# Altium project STM32MiniSYS.PrjPcb
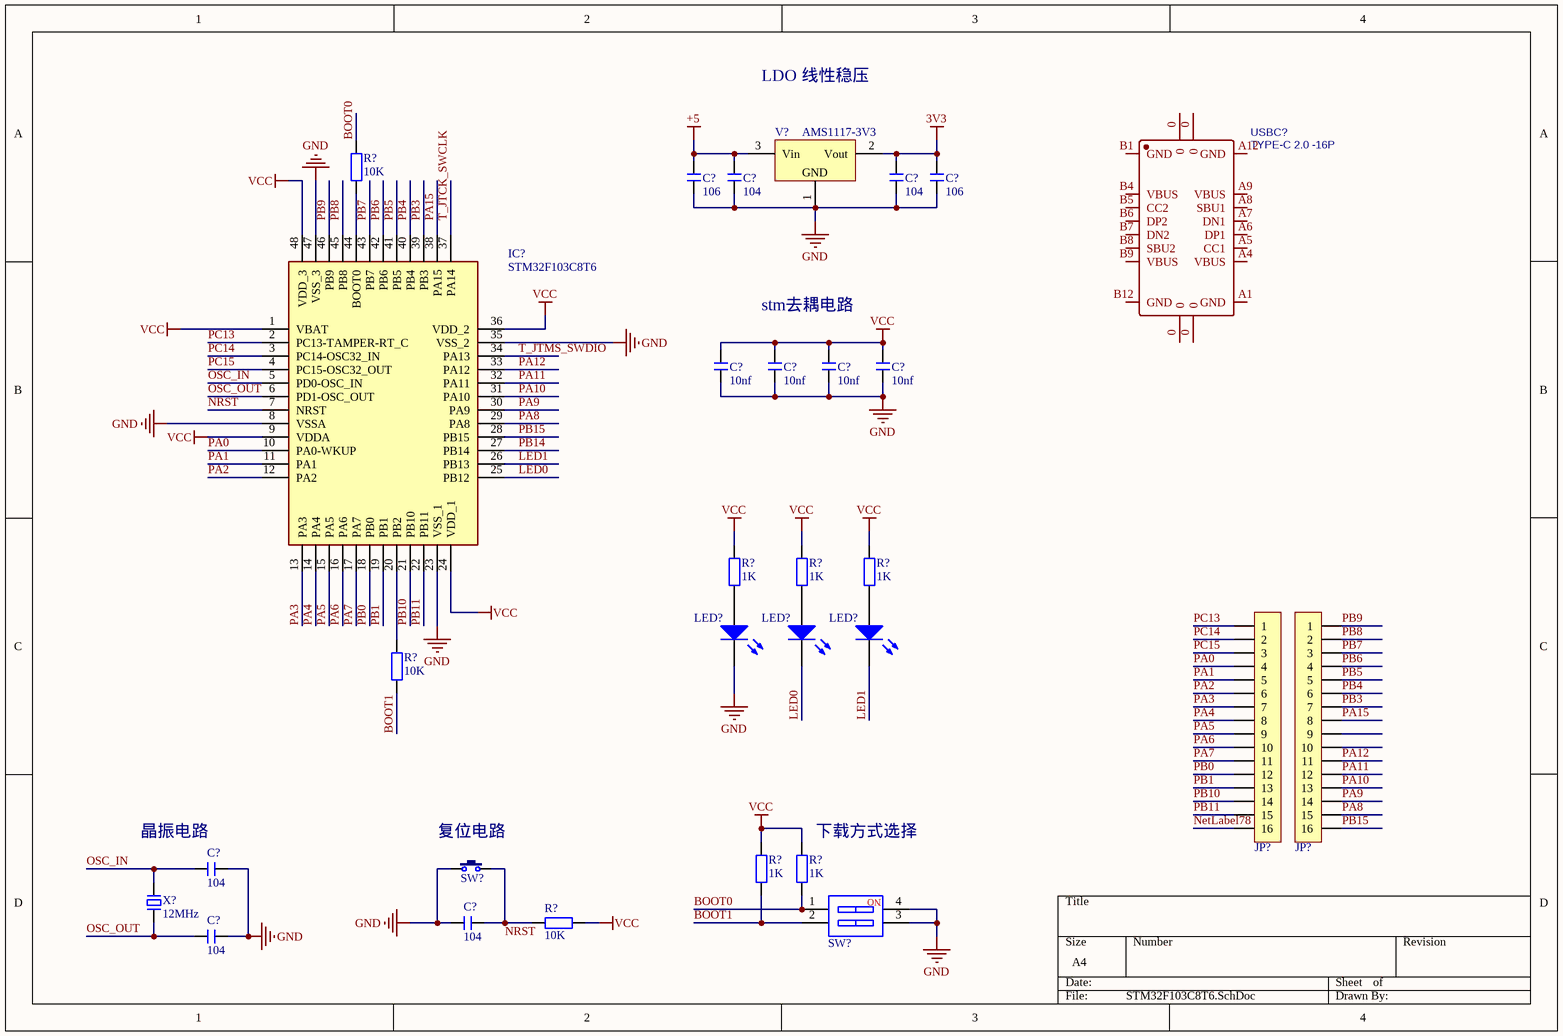
[diagram p0: STM32F103C8T6.SchDoc]
2 sheets, 52 parts. Net scope: global (net labels, ports and power ports of the same name join across sheets).
Board file: PCB.PcbDoc
Sheets:
  STM32F103C8T6.SchDoc
  ST-LINK.SchDoc

## Sheet STM32F103C8T6.SchDoc
size A4; SheetNumber: 1; SheetTotal: 2

### Parts
(Parts that share a designator on the sheet are numbered #1, #2 ... from top to bottom, then left to right.)
C?#1  106  [C0201_L]
C?#2  104  [C0201_L]
C?#3  104  [C0201_L]
C?#4  106  [C0201_L]
C?#5  10nf  [C0201_L]
C?#6  10nf  [C0201_L]
C?#7  10nf  [C0201_L]
C?#8  10nf  [C0201_L]
C?#9  104  [C0201_L]
C?#10  104  [C0201_L]
C?#11  104  [C0201_L]
IC?#1  STM32F103C8T6  [QFP50P900X900X160-48N]
JP?#1  HDR-1X16  [HDR2.54-LI-16P]  (value not drawn)
JP?#2  HDR-1X16  [HDR2.54-LI-16P]  (value not drawn)
LED?#1  (no value)  [LED0603_G]
LED?#2  (no value)  [LED0603_G]
LED?#3  (no value)  [LED0603_G]
R?#1  10K  [R0805_L]
R?#2  1K  [R0805_L]
R?#3  1K  [R0805_L]
R?#4  1K  [R0805_L]
R?#5  10K  [R0805_L]
R?#6  1K  [R0805_L]
R?#7  1K  [R0805_L]
R?#8  10K  [R0805_L]
SW?#1  3x6x5  [SW SMD-3*6*5]  (value not drawn)
SW?#2  SW-2P  [SW DIP-2P]  (value not drawn)
USBC?  TYPE-C 2.0 -16P  [USB-C-SMD_TYPE-C-USB-5]
V?  AMS1117-3V3  [SOT223_L]
X?#1  12MHz  [OSC 5032-2P]

### Nets
3V3: C?#3.2 C?#4.2 V?.2(Vout)
+5: C?#1.2 C?#2.2 V?.3(Vin)
GND: C?#1.1 C?#2.1 C?#3.1 C?#4.1 C?#5.1 C?#6.1 C?#7.1 C?#8.1 C?#9.2 C?#10.1 C?#11.2 IC?#1.8(VSSA) IC?#1.23(VSS_1) IC?#1.35(VSS_2) IC?#1.47(VSS_3) LED?#1.2(K) SW?#1.1 SW?#2.3 SW?#2.4 V?.1(GND)
VCC: C?#5.2 C?#6.2 C?#7.2 C?#8.2 IC?#1.1(VBAT) IC?#1.9(VDDA) IC?#1.24(VDD_1) IC?#1.36(VDD_2) IC?#1.48(VDD_3) R?#2.2 R?#3.2 R?#4.2 R?#6.2 R?#7.2 R?#8.2
BOOT0: R?#1.2 R?#7.1 SW?#2.1
BOOT1: R?#5.1 R?#6.1 SW?#2.2
LED0: IC?#1.25(PB12) LED?#2.2(K)
LED1: IC?#1.26(PB13) LED?#3.2(K)
NetLabel78: JP?#1.16
NRST: C?#10.2 IC?#1.7(NRST) R?#8.1 SW?#1.2
OSC_IN: C?#9.1 IC?#1.5(PD0-OSC_IN) X?#1.2
OSC_OUT: C?#11.1 IC?#1.6(PD1-OSC_OUT) X?#1.1
PA0: IC?#1.10(PA0-WKUP) JP?#1.4
PA1: IC?#1.11(PA1) JP?#1.5
PA2: IC?#1.12(PA2) JP?#1.6
PA3: IC?#1.13(PA3) JP?#1.7
PA4: IC?#1.14(PA4) JP?#1.8
PA5: IC?#1.15(PA5) JP?#1.9
PA6: IC?#1.16(PA6) JP?#1.10
PA7: IC?#1.17(PA7) JP?#1.11
PA8: IC?#1.29(PA8) JP?#2.15
PA9: IC?#1.30(PA9) JP?#2.14
PA10: IC?#1.31(PA10) JP?#2.13
PA11: IC?#1.32(PA11) JP?#2.12
PA12: IC?#1.33(PA12) JP?#2.11
PA15: IC?#1.38(PA15) JP?#2.8
PB0: IC?#1.18(PB0) JP?#1.12
PB1: IC?#1.19(PB1) JP?#1.13
PB3: IC?#1.39(PB3) JP?#2.7
PB4: IC?#1.40(PB4) JP?#2.6
PB5: IC?#1.41(PB5) JP?#2.5
PB6: IC?#1.42(PB6) JP?#2.4
PB7: IC?#1.43(PB7) JP?#2.3
PB8: IC?#1.45(PB8) JP?#2.2
PB9: IC?#1.46(PB9) JP?#2.1
PB10: IC?#1.21(PB10) JP?#1.14
PB11: IC?#1.22(PB11) JP?#1.15
PB14: IC?#1.27(PB14)
PB15: IC?#1.28(PB15) JP?#2.16
PC13: IC?#1.2(PC13-TAMPER-RT_C) JP?#1.1
PC14: IC?#1.3(PC14-OSC32_IN) JP?#1.2
PC15: IC?#1.4(PC15-OSC32_OUT) JP?#1.3
T_JTCK_SWCLK: IC?#1.37(PA14)
T_JTMS_SWDIO: IC?#1.34(PA13)
NetIC?#1_20: IC?#1.20(PB2) R?#5.2
NetIC?#1_44: IC?#1.44(BOOT0) R?#1.1
NetLED?#1_1: LED?#1.1(A) R?#2.1
NetLED?#2_1: LED?#2.1(A) R?#3.1
NetLED?#3_1: LED?#3.1(A) R?#4.1

Not connected (* = marked no-connect by the designer): JP?#2 9 10; USBC? 0 A1(GND) A4(VBUS) A5(CC1) A6(DP1) A7(DN1) A8(SBU1) A9(VBUS) A12(GND) B1(GND) B4(VBUS) B5(CC2) B6(DP2) B7(DN2) B8(SBU2) B9(VBUS) B12(GND)

### Notes on the sheet
- LDO 线性稳压
- (near C?#6) stm去耦电路
- 晶振电路
- (near SW?#1) 复位电路
- (near R?#7) 下载方式选择
- (in symbol SW-2P) NO

### Library data of the parts
C?#1-C?#11 = C: 贴片电容; BOM名称: 无极性贴片电容; 淘宝ID: 封装库来自淘宝 ID：黄晶宝石; 联系售后，技术支持: https://shop463601444.taobao.com; 唯一出售店铺网址: https://shop463601444.taobao.com
IC?#1 = stm32f103c8t6: Integrated Circuit; Manufacturer_Name: STMicroelectronics; Datasheet Link: http://media.digikey.com/pdf/Data%20Sheets/ST%20Microelectronics%20PDFS/STM32F103x8,B.pdf; Height: 1.6mm; Manufacturer_Part_Number: stm32f103c8t6; Mouser Part Number: 511-STM32F103C8T6; Mouser Price/Stock: https://www.mouser.co.uk/ProductDetail/STMicroelectronics/STM32F103C8T6?qs=bhCVus9SdFtq6kqxsU5%2FDA%3D%3D; Arrow Part Number: STM32F103C8T6; Arrow Price/Stock: https://www.arrow.com/en/products/stm32f103c8t6/stmicroelectronics?region=nac
JP?#1 JP?#2 = Header 16: 16P接插件; 学习资源: 最新版本发布https://item.taobao.com/item.htm?id=566775463719; 版权归属: 封装库来自淘宝 ID：黄晶宝石; BOM名称: 16P接插件
LED?#1-LED?#3 = LED-SMD: 贴片LED; 版权归属: 封装库来自淘宝 ID：黄晶宝石; BOM名称: 贴片LED
R?#1-R?#8 = R: 贴片电阻; 版权归属: 来自淘宝 ID：黄晶宝石; 封装库来自淘宝卖家 ID：黄晶宝石: 其他店铺购入均为盗版，不享受售后技术支持服务，请立即申请退款; BOM名称: 贴片电阻; 联系售后: https://item.taobao.com/item.htm?id=566775463719
SW?#1 = TSW 3x6: 3x6轻触开关; 版权归属: 封装库来自淘宝 ID：黄晶宝石; BOM名称: 3x6轻触开关; 学习资源: https://shop463601444.taobao.com
SW?#2 = SW-2P: 2路编码开关; 淘宝ID: 封装库来自淘宝 ID：黄晶宝石; BOM名称: 2路编码开关; 学习资源: https://shop463601444.taobao.com
USBC? = USB2.0 Type-C 16Pin母座: USB2.0 Type-C 母座 16Pin; BOM_Supplier: LCSC; BOM_Manufacturer Part: -; spiceSymbolName: TYPE-C 3.1 -16P_C168689
V? = AMS1117: 三端稳压芯片; BOM名称: 稳压芯片; 淘宝ID: 封装库来自淘宝 ID：黄晶宝石; 欢迎光临淘宝店铺: 最新版本发布https://item.taobao.com/item.htm?id=566775463719
X?#1 = XTAL-2P: 2脚无源脚晶振; 版权归属: 封装库来自淘宝卖家 ID：黄晶宝石; BOM名称: 2脚无源脚晶振; 学习资源: https://shop463601444.taobao.com

## Sheet ST-LINK.SchDoc
size A4; SheetNumber: 2; SheetTotal: 2
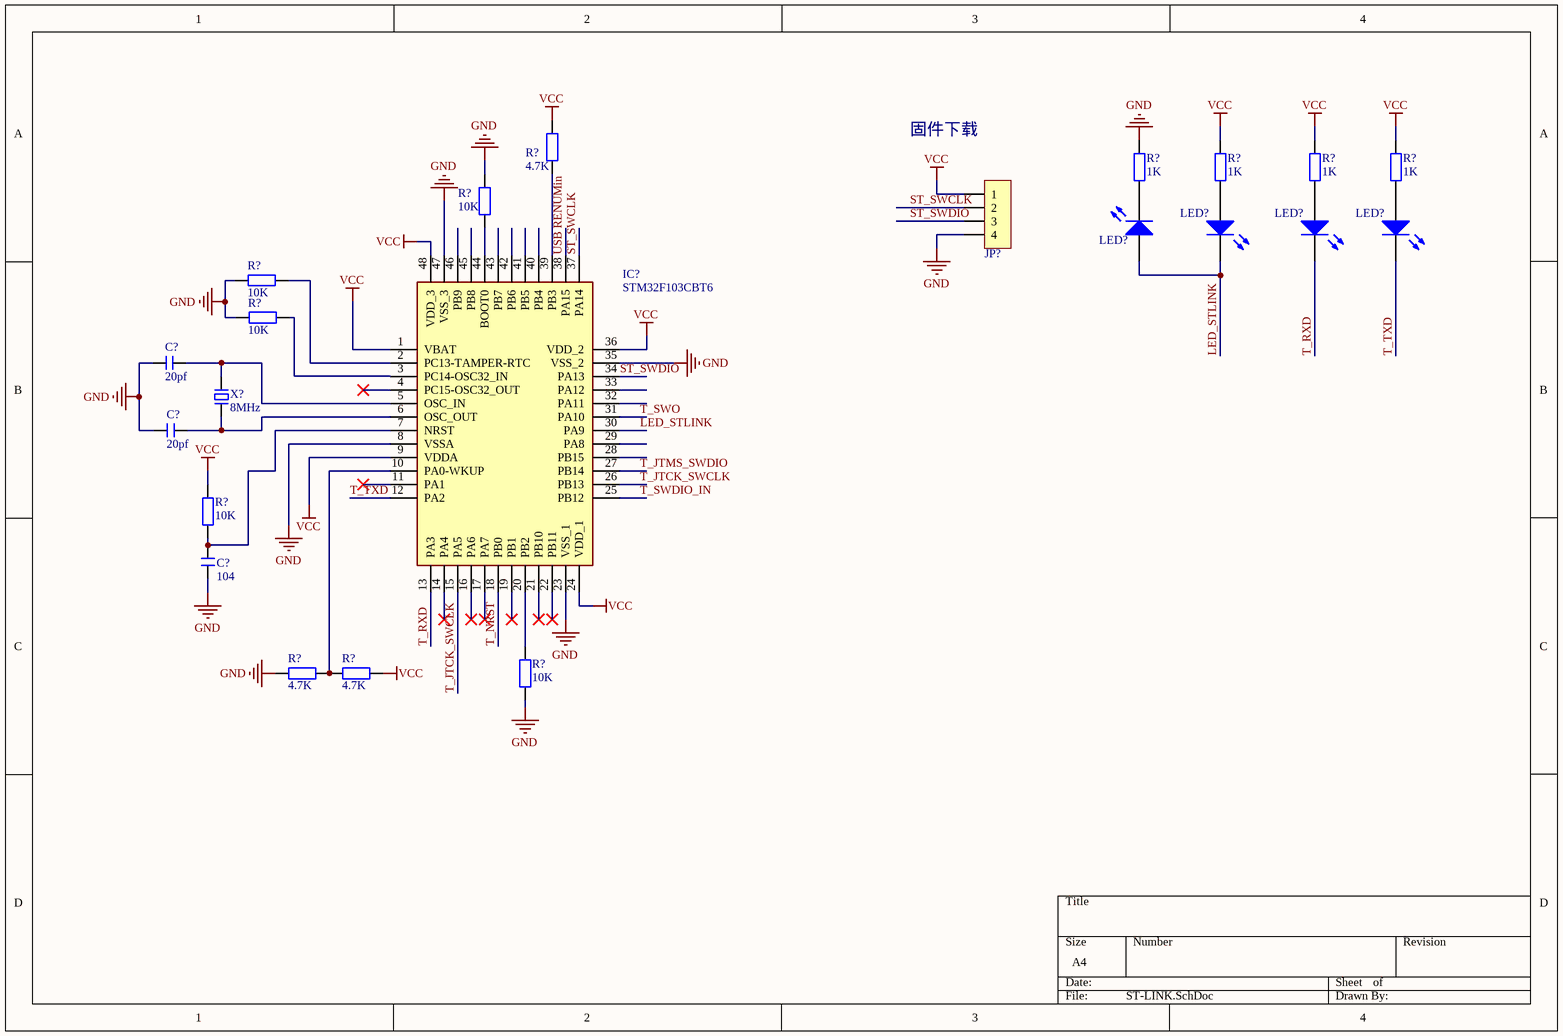
[diagram p1: ST-LINK.SchDoc]

### Parts
(Parts that share a designator on the sheet are numbered #1, #2 ... from top to bottom, then left to right.)
C?#12  20pf  [C0201_L]
C?#13  20pf  [C0201_L]
C?#14  104  [C0201_L]
IC?#2  STM32F103CBT6  [QFP50P900X900X160-48N]
JP?#3  HDR-1X4  [HDR2.54-LI-4P]  (value not drawn)
LED?#4  (no value)  [LED0603_G]
LED?#5  (no value)  [LED0603_G]
LED?#6  (no value)  [LED0603_G]
LED?#7  (no value)  [LED0603_G]
R?#9  4.7K  [R0805_L]
R?#10  1K  [R0805_L]
R?#11  1K  [R0805_L]
R?#12  1K  [R0805_L]
R?#13  1K  [R0805_L]
R?#14  10K  [R0805_L]
R?#15  10K  [R0805_L]
R?#16  10K  [R0805_L]
R?#17  10K  [R0805_L]
R?#18  10K  [R0805_L]
R?#19  4.7K  [R0805_L]
R?#20  4.7K  [R0805_L]
X?#2  8MHz  [OSC 5032-2P]

### Nets
GND: C?#12.1 C?#13.1 C?#14.1 IC?#2.8(VSSA) IC?#2.23(VSS_1) IC?#2.35(VSS_2) IC?#2.47(VSS_3) JP?#3.4 R?#10.2 R?#14.2 R?#15.2 R?#16.2 R?#18.2 R?#19.1
VCC: IC?#2.1(VBAT) IC?#2.9(VDDA) IC?#2.24(VDD_1) IC?#2.36(VDD_2) IC?#2.48(VDD_3) JP?#3.1 R?#9.2 R?#11.2 R?#12.2 R?#13.2 R?#17.1 R?#20.2
LED_STLINK: IC?#2.30(PA9) LED?#4.1(A) LED?#5.2(K)
ST_SWCLK: IC?#2.37(PA14) JP?#3.2
ST_SWDIO: IC?#2.34(PA13) JP?#3.3
T_JTCK_SWCLK: IC?#2.15(PA5) IC?#2.26(PB13)
T_JTMS_SWDIO: IC?#2.27(PB14)
T_NRST: IC?#2.18(PB0)
T_RXD: IC?#2.13(PA3) LED?#6.2(K)
T_SWDIO_IN: IC?#2.25(PB12)
T_SWO: IC?#2.31(PA10)
T_TXD: IC?#2.12(PA2) LED?#7.2(K)
USB RENUMin: IC?#2.38(PA15)
NetC?#12_2: C?#12.2 IC?#2.5(OSC_IN) X?#2.2
NetC?#13_2: C?#13.2 IC?#2.6(OSC_OUT) X?#2.1
NetC?#14_2: C?#14.2 IC?#2.7(NRST) R?#17.2
NetIC?#2_2: IC?#2.2(PC13-TAMPER-RTC) R?#15.1
NetIC?#2_3: IC?#2.3(PC14-OSC32_IN) R?#16.1
NetIC?#2_10: IC?#2.10(PA0-WKUP) R?#19.2 R?#20.1
NetIC?#2_20: IC?#2.20(PB2) R?#18.1
NetIC?#2_39: IC?#2.39(PB3) R?#9.1
NetIC?#2_44: IC?#2.44(BOOT0) R?#14.1
NetLED?#4_2: LED?#4.2(K) R?#10.1
NetLED?#5_1: LED?#5.1(A) R?#11.1
NetLED?#6_1: LED?#6.1(A) R?#12.1
NetLED?#7_1: LED?#7.1(A) R?#13.1

Not connected (* = marked no-connect by the designer): IC?#2 4(PC15-OSC32_OUT)* 11(PA1)* 14(PA4)* 16(PA6)* 17(PA7)* 19(PB1)* 21(PB10)* 22(PB11)* 28(PB15) 29(PA8) 32(PA11) 33(PA12) 40(PB4) 41(PB5) 42(PB6) 43(PB7) 45(PB8) 46(PB9)

### Notes on the sheet
- 固件下载

### Library data of the parts
C?#12-C?#14 = C: as C?#1 on sheet STM32F103C8T6; 联系售后，技术支持: https://shop463601444.taobao.com; 唯一出售店铺网址: https://shop463601444.taobao.com
IC?#2 = STM32F103CBT6: Integrated Circuit; Manufacturer_Name: STMicroelectronics; Datasheet Link: http://www.st.com/st-web-ui/static/active/en/resource/technical/document/datasheet/CD00161566.pdf; Height: 1.6mm; Manufacturer_Part_Number: STM32F103CBT6; Mouser Part Number: 511-STM32F103CBT6; Mouser Price/Stock: https://www.mouser.co.uk/ProductDetail/STMicroelectronics/STM32F103CBT6?qs=WxFF5lh7QM3goh6GV5Ogig%3D%3D; Arrow Part Number: STM32F103CBT6; Arrow Price/Stock: https://www.arrow.com/en/products/stm32f103cbt6/stmicroelectronics?utm_currency=USD&region=nac
JP?#3 = Header 4: 4P接插件; 版权归属: 封装库来自淘宝 ID：黄晶宝石; 学习资源: 最新版本发布https://item.taobao.com/item.htm?id=566775463719; BOM名称: 4P接插件
LED?#4-LED?#7 = LED-SMD: 贴片LED; 版权归属: 封装库来自淘宝 ID：黄晶宝石; BOM名称: 贴片LED
R?#9-R?#20 = R: as R?#1 on sheet STM32F103C8T6; BOM名称: 贴片电阻; 联系售后: https://item.taobao.com/item.htm?id=566775463719
X?#2 = XTAL-2P: 2脚无源脚晶振; 版权归属: 封装库来自淘宝卖家 ID：黄晶宝石; BOM名称: 2脚无源脚晶振; 学习资源: https://shop463601444.taobao.com

## Nets that join several sheets
GND: STM32F103C8T6 (20 pins), ST-LINK (14 pins)
VCC: STM32F103C8T6 (15 pins), ST-LINK (12 pins)
T_JTCK_SWCLK: STM32F103C8T6 (IC?#1.37), ST-LINK (IC?#2.15 IC?#2.26)
T_JTMS_SWDIO: STM32F103C8T6 (IC?#1.34), ST-LINK (IC?#2.27)